# EAGLE schematic attenuverter (EAGLE 7.1.0)
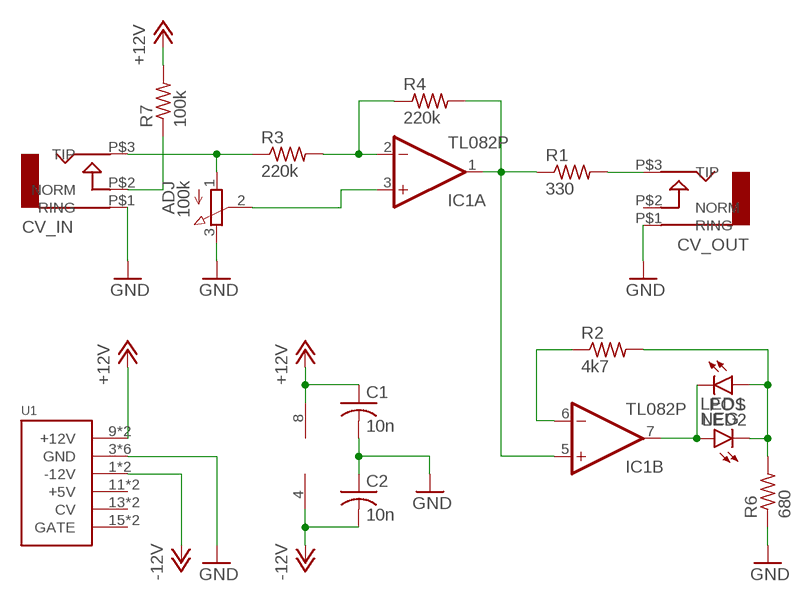
[diagram p0: schematic, sheet 1]

## Parts
ADJ  100k  3RP/1610N  [3RP/1610N]
C1  10n  C-US025-024X044  [C025-024X044]
C2  10n  C-US025-024X044  [C025-024X044]
CV_IN  AUDIO-JACK  [ERTHENVAR-JACK-90DEG]
CV_OUT  AUDIO-JACK  [ERTHENVAR-JACK-90DEG]
IC1  TL082P  [DIL08]
LED1  NEG  LED5MM  [LED5MM]
LED2  POS  LED5MM  [LED5MM]
R1  330  R-US_0207/10  [0207/10]
R2  4k7  R-US_0207/10  [0207/10]
R3  220k  R-US_0207/10  [0207/10]
R4  220k  R-US_0207/10  [0207/10]
R6  680  R-US_0207/10  [0207/10]
R7  100k  R-US_0207/10  [0207/10]
U1  POWER  [POWER_16]

## Nets
+12V: C1.1 IC1.8(P:V+) R7.2 U1.9(+12V) U1.10(+12V)
-12V: C2.2 IC1.4(P:V-) U1.1(-12V) U1.2(-12V)
GND: ADJ.3(E) C1.2 C2.1 CV_IN.P$1(RING) CV_OUT.P$1(RING) R6.1 U1.3(GND) U1.4(GND) U1.5(GND) U1.6(GND) U1.7(GND) U1.8(GND)
N$2: ADJ.1(A) CV_IN.P$3(TIP) R3.1
N$3: IC1.2(A:-IN) R3.2 R4.1
N$4: IC1.1(A:OUT) IC1.5(B:+IN) R1.1 R4.2
N$5: CV_OUT.P$3(TIP) R1.2
N$6: ADJ.2(S) IC1.3(A:+IN)
N$7: IC1.7(B:OUT) LED1.K(C) LED2.A
N$8: LED1.A LED2.K(C) R2.2 R6.2
N$9: IC1.6(B:-IN) R2.1
N$11: CV_IN.P$2(NORM) R7.1
Unconnected: CV_OUT.P$2(NORM) U1.11(+5V) U1.12(+5V) U1.13(CV) U1.14(CV) U1.15(GATE) U1.16(GATE)

## Library data of the parts
ADJ = pot:3RP/1610N: 16mm Potentiometer one level Source: http://www.alphapotentiometers.net/html/16mm_pot_2.html
C1 C2 = rcl:C-US: CAPACITOR, American symbol
CV_IN CV_OUT = erthenvar:AUDIO-JACK: Switching Mono 3.5mm Audio Jack from Erthenvar.
IC1 = linear:TL082: OP AMP Data sheet <http://www.ti.com/lit/ds/symlink/tl084a . pdf>; DATA_SHEET: <a href="http://www.ti.com/lit/ds/symlink/tl084a.pdf"> Data sheet </a>
LED1 LED2 = SparkFun-LED:LED: LEDs Standard schematic elements and footprints for 5mm, 3mm, 1206, and 0603 sized LEDs. 5mm - Spark Fun Electronics SKU : COM-00529 (and others)
R1-R4 R6 R7 = rcl:R-US_: RESISTOR, American symbol
U1 = eurorack:POWER